# EAGLE design electrical_base (EAGLE 9.6.2)
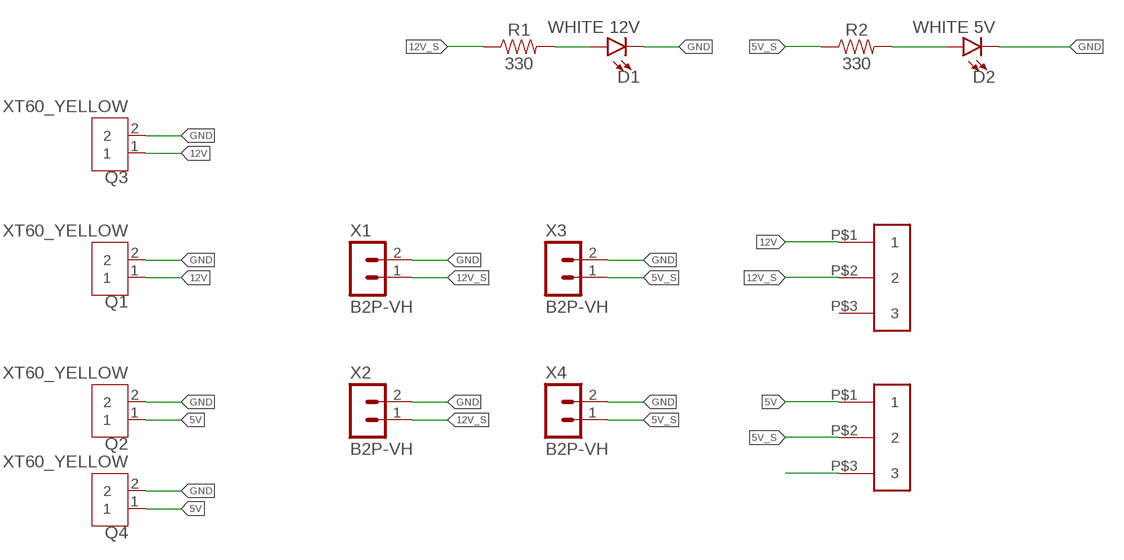
[diagram p0: schematic, sheet 1]

## Parts
D1  WHITE 12V  LED-WHITE1206  [LED-1206]
D2  WHITE 5V  LED-WHITE1206  [LED-1206]
Q1  XT60_YELLOW  [AMASS_XT60PB-M]
Q2  XT60_YELLOW  [AMASS_XT60PB-M]
Q3  XT60_YELLOW  [AMASS_XT60PB-M]
Q4  XT60_YELLOW  [AMASS_XT60PB-M]
R1  330  330OHM-0603-1/10W-1%  [0603]
R2  330  330OHM-0603-1/10W-1%  [0603]
U$1  SWITCH_3P_4.7  [3P]
U$2  SWITCH_3P_4.7  [3P]
X1  B2P-VH  [B2P-VH]
X2  B2P-VH  [B2P-VH]
X3  B2P-VH  [B2P-VH]
X4  B2P-VH  [B2P-VH]

## Nets
5V: Q2.1 Q4.1 U$2.P$1
5V_S: R2.1 U$2.P$2 X3.1 X4.1
12V: Q1.1 Q3.1 U$1.P$1
12V_S: R1.1 U$1.P$2 X1.1 X2.1
GND: D1.C D2.C Q1.2 Q2.2 Q3.2 Q4.2 X1.2 X2.2 X3.2 X4.2
N$7: U$2.P$3
N$9: D1.A R1.2
N$10: D2.A R2.2
Unconnected: U$1.P$3

## Library data of the parts
D1 D2 = SparkFun-LED:LED-WHITE: White SMD LED Used in manufacturing several products at SparkFun. Packages: 0603 - Bright White SMD 0603 package[Product Link] <http://www.kingbrightusa.com/product.asp?catalog_name=LED&product_id=APT1608QWF/D> 1206 - Bright White SMD1206 package [Product Link] <http://www.kingbrightusa.com/product.asp?catalog_name=LED&product_id=APT3216QWF/D> 3014 - Super Bright SMD 3014 package [Datasheet] <http://www.lumileds.com/uploads/459/DS208-pdf> SparkFun Products: Blackberry Trackballer Breakout <https://www.sparkfun.com/products/13169> Digital SandBox <https://www.sparkfun.com/products/12651>; PROD_ID: DIO-09955; VALUE: WHITE
Q1-Q4 = XT60_YELLOW:XT60_YELLOW: Connector 2 pins; AVAILABILITY: Unavailable; DESCRIPTION: Power connector; 65A; PIN: 2; Colour: yellow; MF: Pololu; MP: XT60 YELLOW; PACKAGE: None; PRICE: None
R1 R2 = SparkFun-Resistors:330OHM: 330Ω resistor A resistor is a passive two-terminal electrical component that implements electrical resistance as a circuit element. Resistors act to reduce current flow, and, at the same time, act to lower voltage levels within circuits. - Wikipedia; PROD_ID: RES-00818
U$1 U$2 = switch_3p_4.7mm:SWITCH_3P_4.7
X1-X4 = con-JST VH:B2P-VH: JST VH Series header 3.96mm pitch disconnectable crimp style connectors, vertical (side entry type), 2 pins

## Net classes
0 default: width 0.203 mm, clearance 0.102 mm

## Board
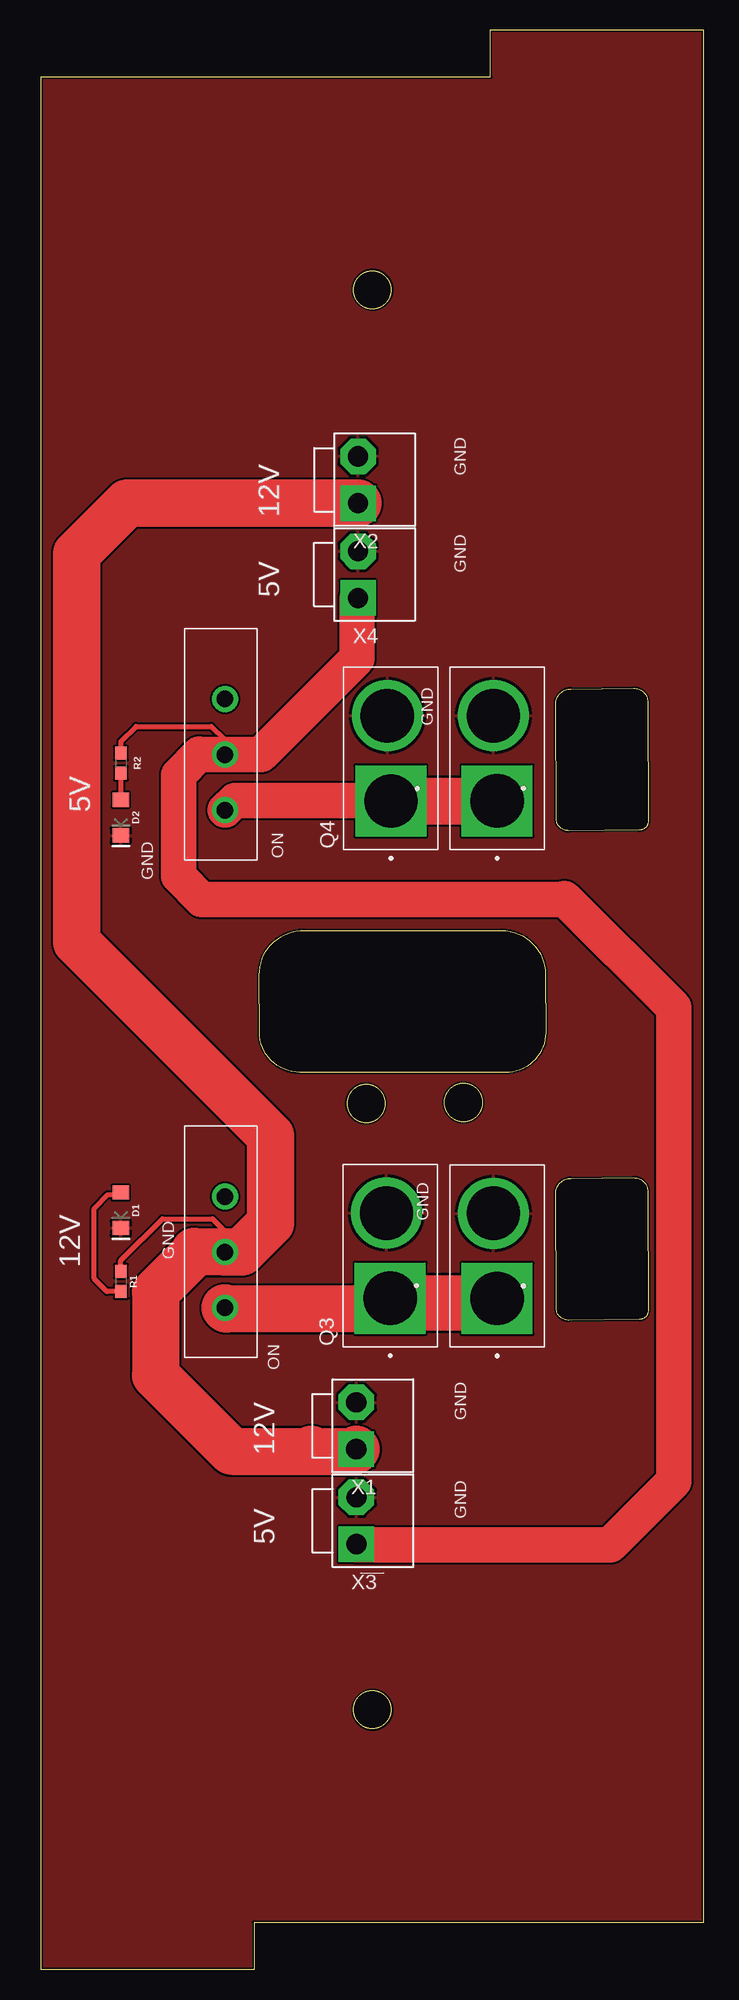
[diagram p1: board, top side]
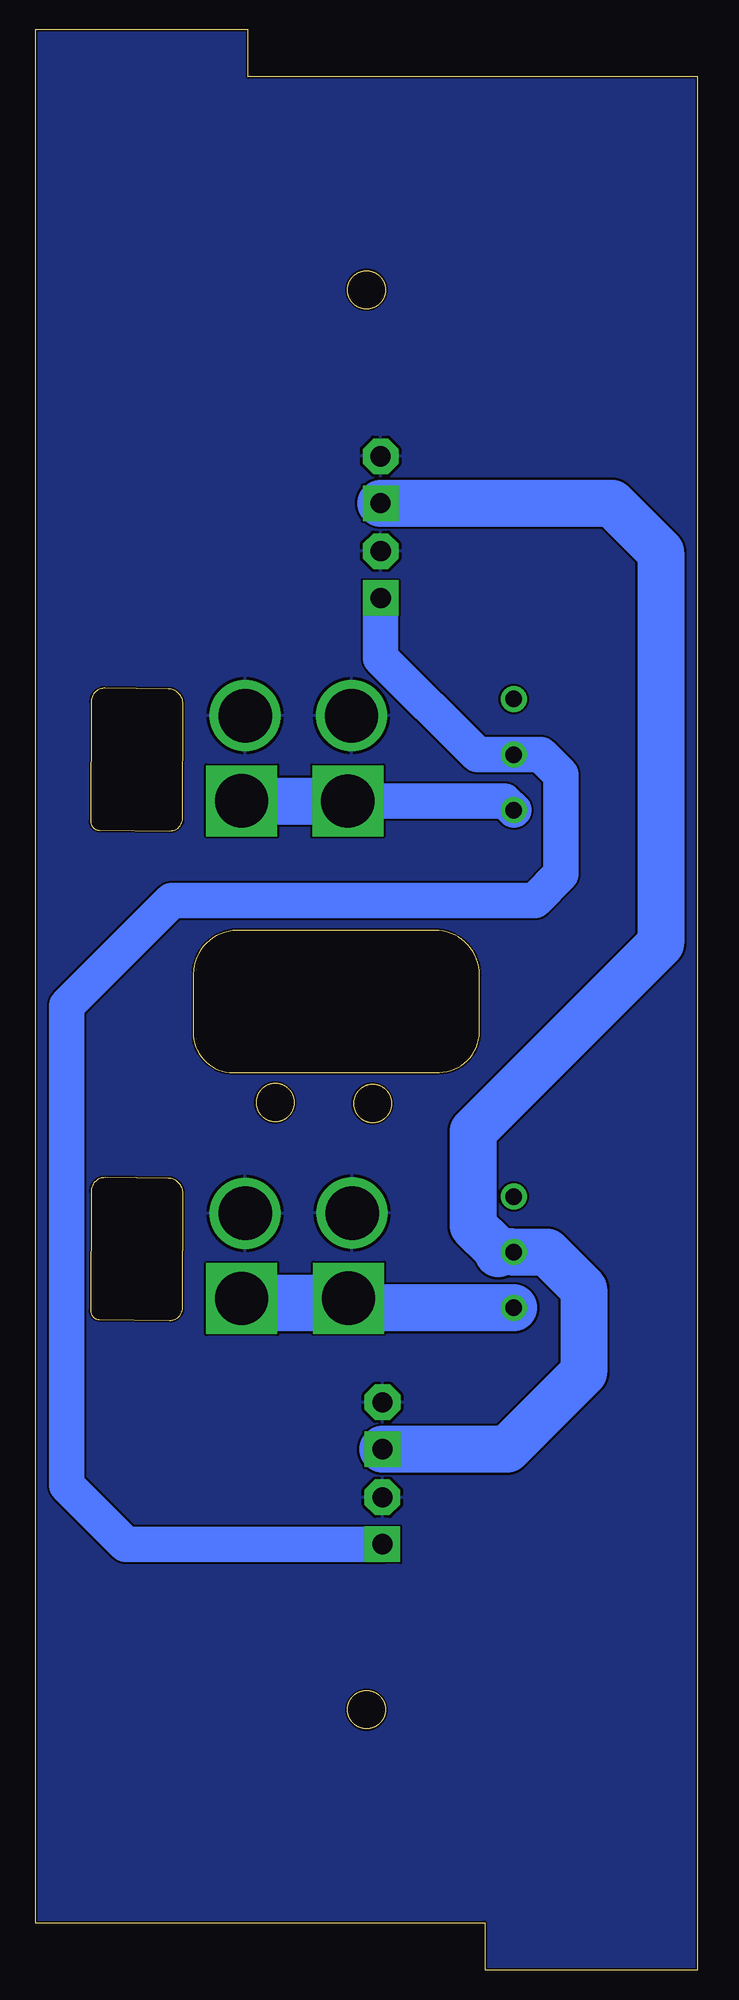
[diagram p2: board, bottom side, seen from below]

Size 56 x 164 mm. Coordinates in mm from the lower left corner, seen from the top.
Outline: 0,160 38,160 38,164 56,164 56,4 18,4 18,0 0,0 0,160
Outline: 22.22,87.87 38.94,87.85 arc-90 42.64,84.16 42.65,79.25 arc-90 39.27,75.86 21.84,75.87 arc-90 18.45,79.26 18.43,84.07 arc-90 22.22,87.87
Outline: 44.78,108.28 50.1,108.33 arc-90 51.29,107.16 51.32,97.08 arc-90 50.59,96.34 44.62,96.28 arc-90 43.54,97.34 43.51,106.99 arc-90 44.78,108.28
Outline: 44.78,66.91 50.1,66.96 arc-90 51.29,65.79 51.32,55.71 arc-90 50.59,54.97 44.62,54.91 arc-90 43.54,55.97 43.51,65.62 arc-90 44.78,66.91
Outline: circle at 27.47,73.23 radius 1.6
Outline: circle at 35.71,73.32 radius 1.6
Outline: circle at 28,142 radius 1.6
Outline: circle at 28,22 radius 1.6
Copper layers (1*16): Top 0.035mm / dielectric 1.5mm / Bottom 0.035mm
Design rules "SparkFun-2-Layer-General-JLCPCB": minimum track width 7mil, minimum drill 0.3mm, track to track 7mil, track to pad 7mil, pad to pad 7mil, via to via 7mil, smd to smd 7mil, copper to edge 7mil, drill to drill 7mil, minimum pad ring 7mil, minimum via ring 7mil, stop-mask expansion 3mil, vias tented up to drill 25mil, thermal gap 10mil

### Footprints (pad centres in the part's own frame; a part is rotated, then mirrored left to right if it is on the bottom)
LED-1206 = smd 1.2 x 1.4: A -1.5,0; C 1.5,0
AMASS_XT60PB-M = drill 4.5 pad 6 square: 1 -3.6,0 | drill 4.5 pad 6: 2 3.6,0.305
0603 = smd 1.1 x 1: 1 -0.85,0; 2 0.85,0
3P = drill 1.4 pad 2.2: P$1 -1.7,0.1; P$2 3,0.1; P$3 7.7,0.1
B2P-VH = drill 1.7 pad 3 square: 1 -1.98,0 | drill 1.7 pad 3 octagon: 2 1.98,0

### Placement (x,y rotation side)
D1  6.74,64.2 270 top
D2  6.74,97.4 270 top
Q1  38.55,60.35 90 top
Q2  38.55,102.41 90 top
Q3  29.51,60.37 90 top
Q4  29.57,102.4 90 top
R1  6.74,58.19 270 top
R2  6.74,101.99 270 top
U$1  15.64,57.67 90 top
U$2  15.64,99.72 90 top
X1  26.64,46 90 top
X2  26.8,125.95 90 top
X3  26.65,37.96 90 top
X4  26.79,117.94 90 top

### Tracks (layer width: path | path; a pad name or v marks a point on that pad's centre or on a via)
5V
  Top 3: U$2.P$1 16.38,98.85 38.5,98.85 Q2.1
  Top 3.988: Q4.1 38.45,98.8 38.5,98.85
  Bottom 3: U$2.P$1 16.33,98.81 29.54,98.81
  Bottom 3.988: Q2.1 29.54,98.81
5V_S
  Top 0.406: R2.1 6.74,103.82 8.01,105.1 14.37,105.1 15.54,103.93 U$2.P$2
  Top 3: X4.1 26.72,115.89 26.72,110.86 18.59,102.72 U$2.P$2 13.41,102.72 13.37,102.76 11.6,101 11.6,92.46 13.58,90.48 44.16,90.48 44.25,90.57 53.48,81.33 53.48,41.29 48.12,35.93 26.71,35.93 X3.1
  Bottom 0.406: U$2.P$2 15.54,103.32
  Bottom 3: X3.1 48.35,35.98 53.34,40.97 53.34,81.52 44.46,90.4 13.75,90.4 11.54,92.61 11.54,101.02 13.24,102.72 U$2.P$2 18.63,102.72 26.79,110.88 X4.1
12V
  Top 3.988: U$1.P$1 15.64,55.87 29.35,55.87 28.75,56.47 29.3,56.47 | Q1.1 38.27,56.47 29.3,56.47 | Q3.1 38.08,56.77 38.84,56.01 29.75,56.01 29.3,56.47
  Bottom 3.988: U$1.P$1 37.76,55.97 | 37.76,55.97 Q1.1 | Q3.1 36.96,56.77 37.76,55.97
12V_S
  Top 0.406: 15.44,60.56 U$1.P$2 15.54,62.43 14.49,63.48 10.25,63.48 6.74,59.97 R1.1
  Top 3.988: U$1.P$2 13.02,60.67 | 12.94,60.74 13.02,60.67 | 13.02,60.67 13.02,60.65 9.67,57.3 9.67,50.25 16.09,43.83 22.68,43.83 | 22.68,43.83 22.85,44 | 22.68,43.83 26.45,43.83 X1.1
  Top 4: X2.1 7.28,123.97 3.02,119.7 3.02,86.88 19.4,70.5 19.4,63.12 16.95,60.67 U$1.P$2
  Bottom 0.203: 15.48,60.73 U$1.P$2
  Bottom 3.988: X2.1 7.24,123.97 3.12,119.84 3.12,86.75 18.98,70.88 18.98,62.9 17.24,61.15 | 16.86,60.53 16.72,60.67 U$1.P$2 12.74,60.67 9.62,57.55 9.62,50.5 16.11,44.02 X1.1
GND
  pour Top (isolate 0.005): -2.86,164.9 59.93,164.9 59.93,-2.16 -2.86,-2.16
  pour Bottom (isolate 0.005): -2.63,165.13 59.24,165.13 59.24,-1.74 -2.63,-1.74
N$9
  Top 0.203: D1.A 6.32,65.7 6.15,65.53
  Top 0.406: R1.2 5.55,57.34 4.49,58.41 4.49,64.38 5.64,65.53 6.15,65.53
N$10
  Top 0.203: 6.69,101.11 R2.2
  Top 0.406: R2.2 D2.A

### Text on the board
tPlace: GND | 12V | GND | 5V | GND | 5V | ON | GND | GND | 12V | GND | ON | GND | 12V | GND | 5V